# EAGLE design ESP07_CarSentry (EAGLE 8.4.1)
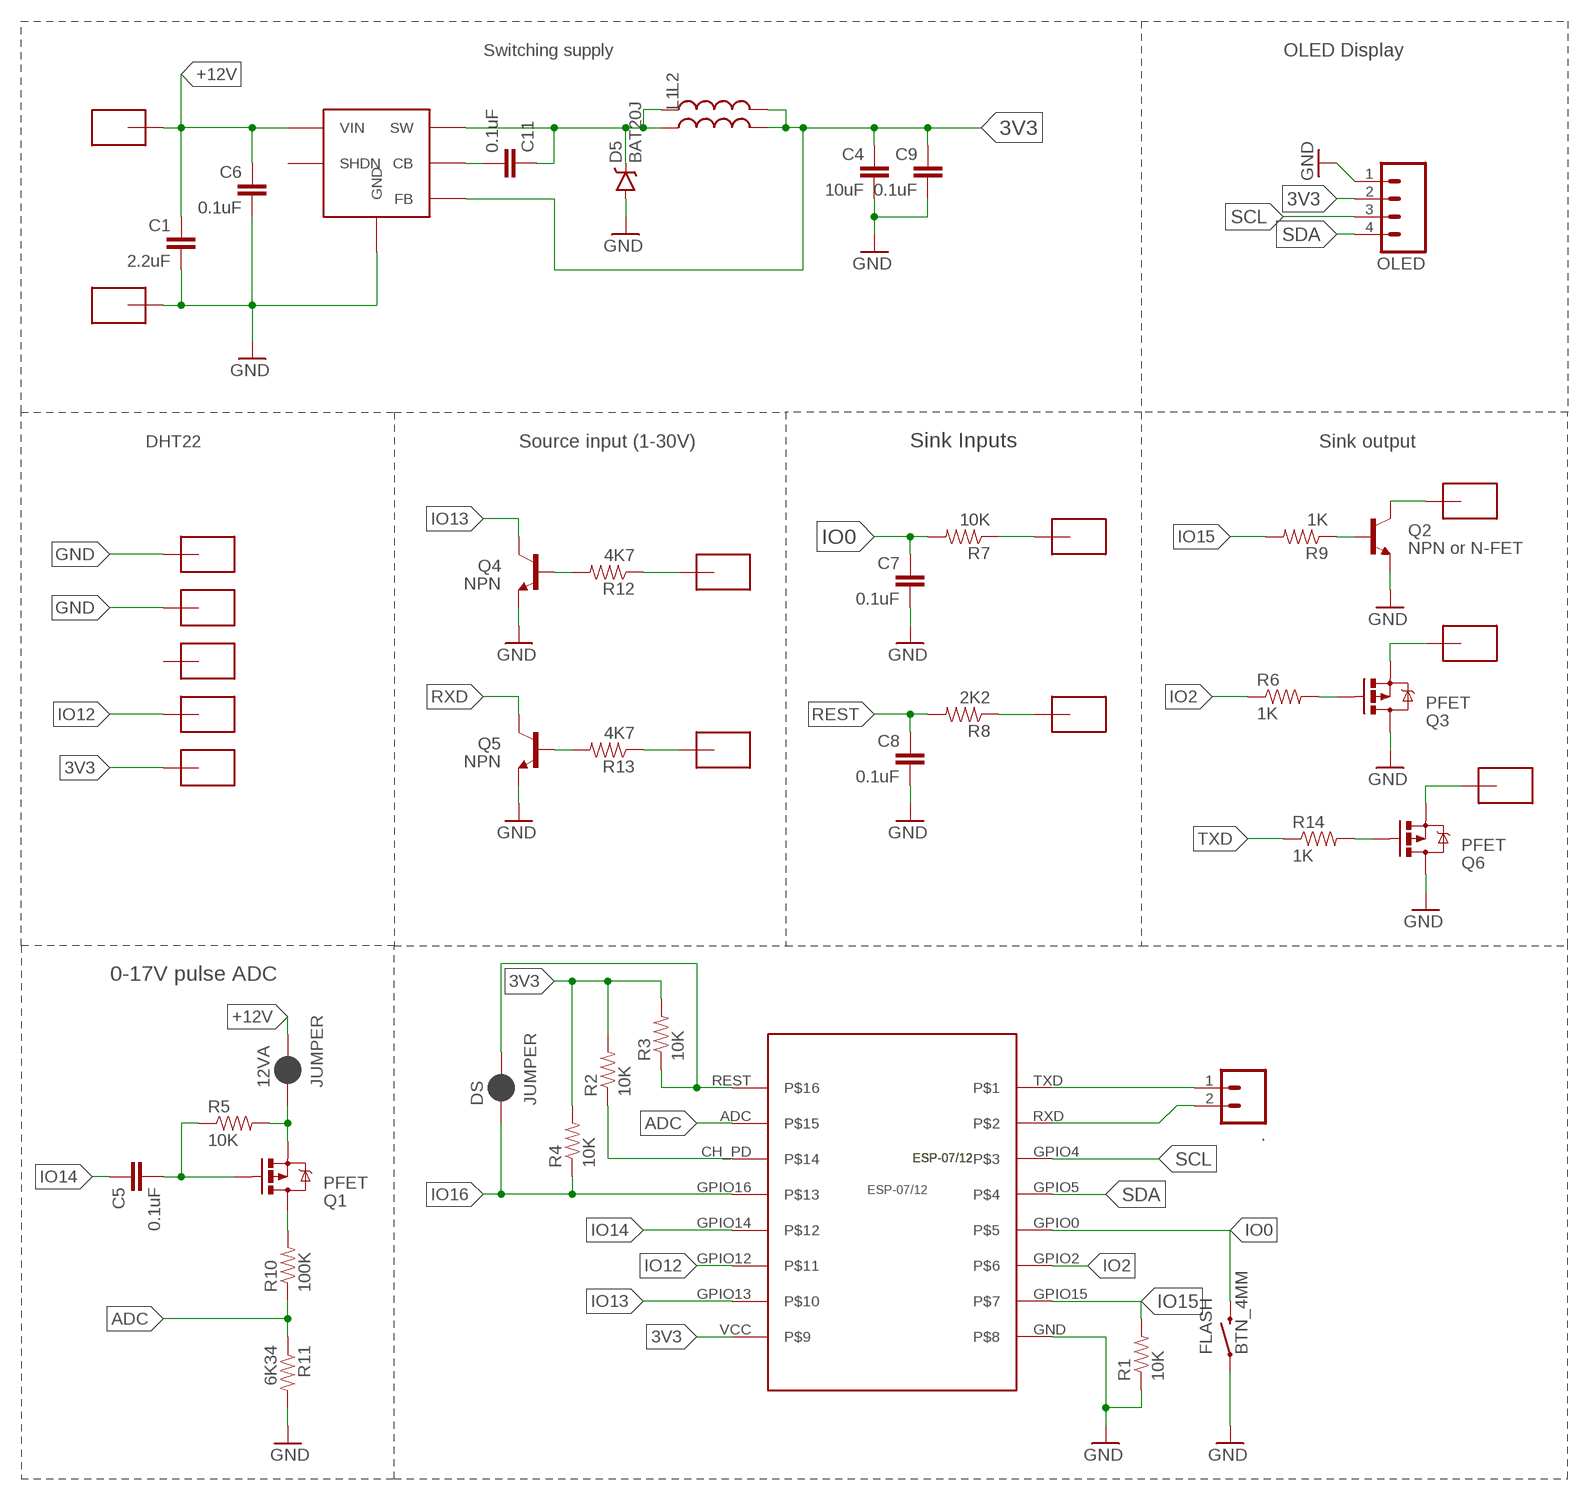
[diagram p0: schematic, sheet 1]

## Parts
12VA  JUMPER  JUMPER-PAD-2-NC_BY_PASTE  [PAD-JUMPER-2-NC_BY_PASTE_YES_SILK]
.  M02PTH  [1X02]
C1  2.2uF  CAP  [0805-CAP]
C4  10uF  CAP  [0805-CAP]
C5  0.1uF  CAP  [0805-CAP]
C6  0.1uF  CAP  [0805-CAP]
C7  0.1uF  CAP  [0805-CAP]
C8  0.1uF  CAP  [0805-CAP]
C9  0.1uF  CAP  [0805-CAP]
C11  0.1uF  CAP  [0805-CAP]
D5  BAT20J  DIODE-SCHOTTKY-BAT20J  [SOD-323]
DS  JUMPER  JUMPER-PAD-2-NC_BY_PASTE  [PAD-JUMPER-2-NC_BY_PASTE_YES_SILK]
FLASH  BTN_4MM  [BTN_4MM]
L1  INDUCTOR0805  [0805]
L2  INDUCTOR0805  [0805]
OLED  M04LOCK  [1X04_LOCK]
Q1  PFET  MOSFET-PCHANNEL  [SOT23-3]
Q2  NPN or N-FET  TRANSISTOR_NPNSOT23-3  [SOT23-3]
Q3  PFET  MOSFET-PCHANNEL  [SOT23-3]
Q4  NPN  TRANSISTOR_NPNSOT23-3  [SOT23-3]
Q5  NPN  TRANSISTOR_NPNSOT23-3  [SOT23-3]
Q6  PFET  MOSFET-PCHANNEL  [SOT23-3]
R1  10K  RESISTOR0805-RES  [0805]
R2  10K  RESISTOR0805-RES  [0805]
R3  10K  RESISTOR0805-RES  [0805]
R4  10K  RESISTOR0805-RES  [0805]
R5  10K  RESISTOR0805-RES  [0805]
R6  1K  RESISTOR0805-RES  [0805]
R7  10K  RESISTOR0805-RES  [0805]
R8  2K2  RESISTOR0805-RES  [0805]
R9  1K  RESISTOR0805-RES  [0805]
R10  100K  RESISTOR0805-RES  [0805]
R11  6K34  RESISTOR0805-RES  [0805]
R12  4K7  RESISTOR0805-RES  [0805]
R13  4K7  RESISTOR0805-RES  [0805]
R14  1K  RESISTOR0805-RES  [0805]
U$1  ESP-07/12  [ESP-07/12]
U$2  SMD-PAD1  [SMD-PAD1]
U$3  SMD-PAD1  [SMD-PAD1]
U$4  SMD-PAD1  [SMD-PAD1]
U$5  SMD-PAD1  [SMD-PAD1]
U$6  SMD-PAD1  [SMD-PAD1]
U$7  SMD-PAD1  [SMD-PAD1]
U$8  SMD-PAD1  [SMD-PAD1]
U$9  SMD-PAD1  [SMD-PAD1]
U$10  SMD-PAD1  [SMD-PAD1]
U$11  SMD-PAD1  [SMD-PAD1]
U$12  SMD-PAD1  [SMD-PAD1]
U$13  SMD-PAD1  [SMD-PAD1]
U$14  SMD-PAD1  [SMD-PAD1]
U$16  SMD-PAD1  [SMD-PAD1]
VREG1  LMR16006YQ3DDCRQ1  LMR16006YQ  [SOT-23-6]

## Nets
3V3: C4.1 C9.1 L1.2 L2.2 OLED.2 R2.2 R3.2 R4.2 U$1.VCC U$4.>NAME VREG1.3(FB)
+12V: 12VA.2 C1.1 C6.1 U$16.>NAME VREG1.5(VIN)
ADC: R10.1 R11.1 U$1.ADC
ADCHI: 12VA.1 Q1.2(S) R5.2
GND: C1.2 C4.2 C6.2 C7.2 C8.2 C9.2 D5.A FLASH.1 OLED.1 Q2.2(E) Q3.3(D) Q4.2(E) Q5.2(E) Q6.3(D) R1.1 R11.2 U$1.GND U$6.>NAME U$8.>NAME U$11.>NAME VREG1.2(GND)
IO0: C7.1 FLASH.2 R7.2 U$1.GPIO0
IO2: R6.1 U$1.GPIO2
IO12: U$1.GPIO12 U$5.>NAME
IO13: Q4.3(C) U$1.GPIO13
IO14: C5.1 U$1.GPIO14
IO15: R1.2 R9.2 U$1.GPIO15
IO16: DS.1 R4.1 U$1.GPIO16
N$1: Q1.3(D) R10.2
N$2: Q3.1(G) R6.2
N$3: C5.2 Q1.1(G) R5.1
N$4: Q3.2(S) U$9.>NAME
N$5: R7.1 U$14.>NAME
N$6: Q2.1(B) R9.1
N$7: Q2.3(C) U$3.>NAME
N$8: R8.1 U$12.>NAME
N$9: Q4.1(B) R12.2
N$10: R12.1 U$2.>NAME
N$11: R2.1 U$1.CH_PD
N$12: Q5.1(B) R13.2
N$13: C11.1 D5.C L1.1 L2.1 VREG1.6(SW)
N$14: C11.2 VREG1.1(CB)
N$15: R13.1 U$10.>NAME
N$16: Q6.2(S) U$13.>NAME
N$17: Q6.1(G) R14.2
REST: C8.1 DS.2 R3.1 R8.2 U$1.REST
RXD: ..2 Q5.3(C) U$1.RXD
SCL: OLED.3 U$1.GPIO4
SDA: OLED.4 U$1.GPIO5
TXD: ..1 R14.1 U$1.TXD
Unconnected: U$7.>NAME VREG1.4(SHDN)

## Notes on the sheet
- Switching supply | OLED Display
- DHT22 | Source input (1-30V) | Sink Inputs | Sink output
- 0-17V pulse ADC

## Library data of the parts
12VA DS = SparkFun-Passives:JUMPER-PAD-2-NC_BY_PASTE
. = SparkFun-Connectors:M02: Standard 2-pin 0.1" header. Use with - straight break away headers ( PRT-00116) - right angle break away headers (PRT-00553) - swiss pins (PRT-00743) - machine pins (PRT-00117) - female headers (PRT-00115) Molex polarized connector foot print use with: PRT-08233 with associated crimp pins and housings. 2.54_SCREWTERM for use with PRT-10571. 3.5mm Screw Terminal footprints for PRT-08084 5mm Screw Terminal footprints for use with PRT-08432
C1 C4-C9 C11 = SparkFun-Capacitors:CAP: Capacitor Standard 0603 ceramic capacitor, and 0.1" leaded capacitor.
D5 = SparkFun-DiscreteSemi:DIODE-SCHOTTKY: Schottky diodes in SFE's production catalog BAT20J 1A 23V 0.62Vf RB751 120mA 40V 0.37Vf PMEG4005EJ 0.5A 40V 0.42Vf MBRA140 1A 40V 0.5Vf B340A 3A 40V SMA; PROD_ID: DIO-11623
FLASH = CuriousTech:BTN_4MM
L1 L2 = SparkFun-Passives:INDUCTOR: Inductors Basic Inductor/Choke - 0603 and 1206. Footprints are not proven and vary greatly between part numbers. INDUCTOR POWER 3.3UH 4.0A SMD 0.197" L x 0.197" W x 0.177" H (5.00mm x 5.00mm x 4.50mm)
OLED = SparkFun-Connectors:M04: Header 4 Standard 4-pin 0.1" header. Use with straight break away headers (SKU : PRT-00116), right angle break away headers (PRT-00553), swiss pins (PRT-00743), machine pins (PRT-00117), and female headers (PRT-00115). Molex polarized connector foot print use with SKU : PRT-08231 with associated crimp pins and housings. 1MM SMD Version SKU: PRT-10208; PROD_ID: CONN-09696
Q1 Q3 Q6 = SparkFun-DiscreteSemi:MOSFET-PCHANNEL: Generic PMOSFET IRLML2244 - TRANS-11153 (SOT-23 -20V -4.3A) (1.Gate 2.Source 3.Drain) FQP27P06 - COM-10349 <http://www.sparkfun.com/products/10349> (TO-220 -60V -27A) (1.Gate 2.Source 3.Drain); PROD_ID: TRANS-08285
Q2 Q4 Q5 = SparkFun-DiscreteSemi:TRANSISTOR_NPN: Generic NPN BJT MMBT2222A - TRANS-08049 (SOT-23, 1A 40V) MPSA42 - TRANS-09116 (SOT-23, 500mA 300V) MMBT5088LT1G - TRANS-11160 (SOT-23, 50 mA 30V) BC547 - COM-08928 <http://www.sparkfun.com/products/8928> (TO-92 45V 100mA) (1.Collector 2.Base 3.Emitter) 2N3904 - COM-00521 <http://www.sparkfun.com/products/521> (TO-92 40V 200mA) (1.Emitter 2.Base 3.Collector) P2N2222A - COM-12852 <http://www.sparkfun.com/products/12852> (TO-92 40V 600mA) (1.Collector 2.Base 3.Emitter); PROD_ID: TRANS-08049
R1-R14 = SparkFun-Resistors:RESISTOR: Resistor Basic schematic elements and footprints for 0603, 1206, and PTH resistors.
U$1 = ESP-07_12:ESP-07/12: Version 1.0 of the library for the ESP-07/12 full GPIO dev board module byME Jon jonnyradu@gmail.com
U$2-U$14 U$16 = CuriousTech:SMD-PAD1: SMD-PAD small
VREG1 = CuriousTech:LMR16006YQ

## Board
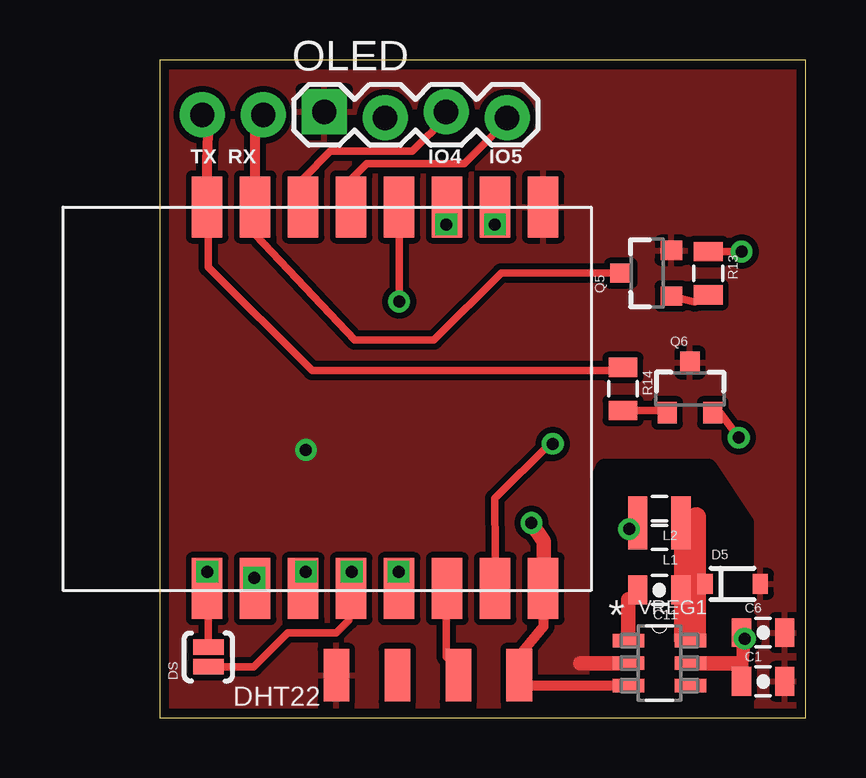
[diagram p1: board, top side]
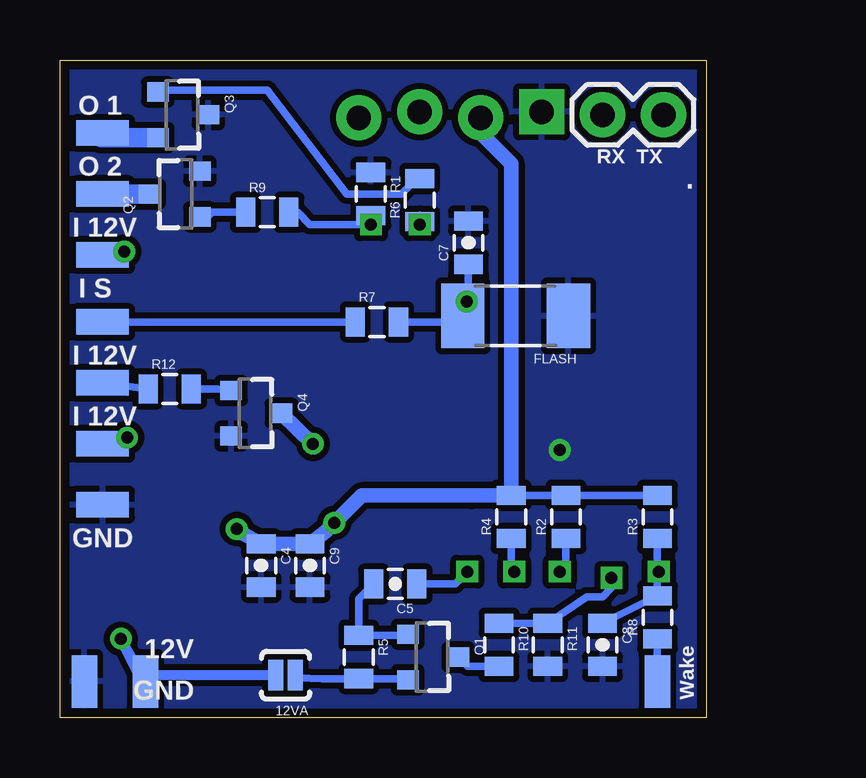
[diagram p2: board, bottom side, seen from below]

Size 26.92 x 27.43 mm. Coordinates in mm from the lower left corner, seen from the top.
Outline: 26.92,0 26.92,27.43 0,27.43 0,0 26.92,0
Copper layers (1*16): Top 0.035mm / dielectric 1.5mm / Bottom 0.035mm
Design rules "default *": minimum track width 10mil, minimum drill 24mil, track to track 8mil, track to pad 8mil, pad to pad 8mil, via to via 8mil, smd to smd 8mil, copper to edge 15mil, drill to drill 8mil, minimum pad ring 10mil, minimum via ring 8mil, stop-mask expansion 4mil, vias tented up to drill 0mil, thermal gap 10mil
tRestrict: area 18.3,0.5 to 24.4,10.4

### Footprints (pad centres in the part's own frame; a part is rotated, then mirrored left to right if it is on the bottom)
PAD-JUMPER-2-NC_BY_PASTE_YES_SILK = smd 0.635 x 1.27: 1 -0.401,0; 2 0.413,0
1X02 = drill 1.016 pad 1.88: 1 0,0; 2 2.54,0
0805-CAP = smd 0.8 x 1.2: 1 -0.9,0; 2 0.9,0
SOD-323 = smd 0.63 x 0.83: A 1.15,0; C -1.15,0
BTN_4MM = smd 1.8 x 2.7: 1 -2.2,0; 2 2.2,0
0805 = smd 0.8 x 1.2: 1 -0.9,0; 2 0.9,0
1X04_LOCK = drill 1.016 pad 1.88 square: 1 0,0.127 | drill 1.016 pad 1.88: 2 2.54,-0.127; 3 5.08,0.127; 4 7.62,-0.127
SOT23-3 = smd 0.8 x 0.9: 1 -0.95,-1; 2 0.95,-1; 3 0,1.1
ESP-07/12 = smd 2.54 x 1.27: ADC 0.1,14; CH_PD 0.1,12; GND 16,2; GPIO0 16,8; GPIO2 16,6; GPIO4 16,12; GPIO5 16,10; GPIO12 0.1,6; GPIO13 0.1,4; GPIO14 0.1,8; GPIO15 16,4; GPIO16 0.1,10; REST 0.1,16; RXD 16,14; TXD 16,16; VCC 0.1,2
SMD-PAD1 = smd 2.184 x 1.067: >NAME 0,0
SOT-23-6 = smd 1.321 x 0.559: 1 -1.295,0.94; 2 -1.295,0; 3 -1.295,-0.94; 4 1.295,-0.94; 5 1.295,0; 6 1.295,0.94

### Placement (x,y rotation side)
12VA  17.53,1.78 180 bottom
.  1.78,25.15 180 bottom
C1  25.15,1.52 0 top
C4  18.54,6.35 270 bottom
C5  12.95,5.59 180 bottom
C6  25.15,3.56 0 top
C7  9.91,19.81 90 bottom
C8  4.32,3.05 270 bottom
C9  16.51,6.35 270 bottom
C11  20.83,5.33 180 top
D5  23.88,5.59 0 top
DS  2.03,2.54 90 top
FLASH  7.94,16.76 180 bottom
L1  20.83,7.62 180 top
L2  20.83,8.64 180 top
OLED  6.86,25.15 0 top
Q1  11.43,2.54 270 bottom
Q2  22.1,21.84 90 bottom
Q3  21.84,25.15 270 bottom
Q4  18.8,12.7 270 bottom
Q5  20.32,18.54 90 top
Q6  22.1,13.72 0 top
R1  13.97,21.84 270 bottom
R2  5.84,8.38 90 bottom
R3  2.03,8.38 90 bottom
R4  8.13,8.38 90 bottom
R5  14.48,2.54 270 bottom
R6  11.94,21.59 90 bottom
R7  13.72,16.51 0 bottom
R8  2.03,4.19 90 bottom
R9  18.29,21.08 0 bottom
R10  8.64,3.05 270 bottom
R11  6.6,3.05 270 bottom
R12  22.35,13.72 0 bottom
R13  22.86,18.54 270 top
R14  19.3,13.72 270 top
U$1  17.98,5.3 90 top
U$2  25.15,13.97 0 bottom
U$3  25.15,21.84 0 bottom
U$4  14.99,1.78 90 top
U$5  12.45,1.78 90 top
U$6  25.91,1.52 270 bottom
U$7  9.91,1.78 90 top
U$8  7.37,1.78 90 top
U$9  25.15,24.38 0 bottom
U$10  25.15,19.3 0 bottom
U$11  25.15,8.89 0 bottom
U$12  2.03,1.52 270 bottom
U$13  25.15,11.43 0 bottom
U$14  25.15,16.51 0 bottom
U$16  23.37,1.52 270 bottom
VREG1  20.83,2.29 0 top

### Tracks (layer width: path | path; a pad name or v marks a point on that pad's centre or on a via)
3V3  (via drill 0.5)
  Top 0.305: 15.42,1.35 U$4.>NAME
  Top 0.406: U$4.>NAME 14.73,2.29 16,3.81 16,5.37 U$1.VCC | VREG1.3 15.42,1.35
  Top 0.61: 16,5.08 16,5.42 | 16,5.42 U$1.VCC | v15.49,8.13 16,7.37 16,5.42 | L2.2 L1.2 19.67,7.87 v19.56,7.87
  Bottom 0.305: R3.2 R2.2 R4.2
  Bottom 0.61: OLED.2 9.4,24.38 8.13,23.11 R4.2 9.26,9.28 9.78,9.27 14.35,9.27 v15.49,8.13 15.86,7.76 C9.1 C4.1 19.44,7.76 v19.56,7.87
+12V  (via drill 0.5)
  Top 0.406: v24.38,3.3 24.38,2.93 C1.1 | C1.1 C6.1 | 23.99,2.29 C1.1
  Top 0.61: VREG1.5 23.99,2.29
  Bottom 0.406: 12VA.2 23.62,1.78 v24.38,3.3 24.25,3.16 24.25,3.05 U$16.>NAME
ADC  (via drill 0.5)
  Top 0.305: v3.95,5.84 3.81,5.33 3.91,5.33 U$1.ADC
  Bottom 0.305: v3.95,5.84 3.98,5.81 U$1.ADC 4.32,5.05 4.97,5.05 R11.1 R10.1
ADCHI
  Bottom 0.305: Q1.2 12.48,1.64 R5.2 16,1.64 17.02,1.67 12VA.1
GND  (via drill 0.5)
  Top 0.61: VREG1.2 17.53,2.29
  other vias: 6.1,11.18
  pour Top (isolate 0.254): 0,0 0,27.69 26.92,27.69 26.92,0
  pour Bottom (isolate 0.254): 26.92,0 0,0 0,27.69 26.92,27.69
IO0  (via drill 0.5)
  Top 0.305: v9.98,17.36 U$1.GPIO0
  Bottom 0.305: FLASH.2 9.88,17.52 v9.98,17.36 | v9.98,17.36 9.98,17.79 11.01,16.51 R7.2 | C7.1 9.91,17.43 v9.98,17.36
IO2  (via drill 0.5)
  Top 0.305: v11.94,20.57 11.94,21.26 U$1.GPIO2
  Bottom 0.305: 11.94,20.95 R6.1 v11.94,20.57
IO12
  Top 0.305: 11.94,5.84 12.08,5.69 12.17,5.59 | 11.94,5.36 11.94,2.54 12.19,2.29 U$5.>NAME
  Top 0.406: 11.94,5.36 U$1.GPIO12 11.98,5.59 12.08,5.69
  Top 0.61: 11.94,5.44 U$1.GPIO12
IO13  (via drill 0.5)
  Top 0.305: U$1.GPIO13 13.98,6.85 13.97,9.14 16.26,11.43 v16.38,11.43
  Bottom 0.61: Q4.3 v16.38,11.43
IO14  (via drill 0.5)
  Top 0.305: v9.96,6.1 9.91,6.09 U$1.GPIO14
  Bottom 0.305: C5.1 10.46,5.59 v9.96,6.1
IO15  (via drill 0.5)
  Top 0.305: U$1.GPIO15 | U$1.GPIO15 v13.98,20.57 v13.97,20.57 U$1.GPIO15
  Bottom 0.305: R1.2 v13.97,20.57 16.51,20.57 17.02,21.08 R9.2
IO16  (via drill 0.5)
  Top 0.305: DS.1 3.92,2.14 5.33,3.56 7.37,3.56 7.87,4.06 7.87,5.3 U$1.GPIO16 7.98,6.45 v8,6.1
  Bottom 0.305: R4.1 8.13,6.22 v8,6.1
N$1
  Bottom 0.305: 8.6,2.2 R10.2 9.94,2.15 Q1.3
N$2
  Bottom 0.305: R6.2 12.05,22.49 12.7,21.84 14.99,21.84 18.29,26.16 23.03,26.16 Q3.1
N$3
  Bottom 0.305: C5.2 14.48,4.96 R5.1 12.48,3.44 Q1.1
  Bottom 0.406: 14.34,3.3 R5.1
N$4
  Bottom 0.813: Q3.2 25.21,24.2 U$9.>NAME
N$5
  Bottom 0.305: R7.1 U$14.>NAME
N$6
  Bottom 0.305: R9.1 20.57,21.08 20.83,20.83 21.03,20.83 Q2.1
N$7
  Bottom 0.813: Q2.3 U$3.>NAME
N$8
  Bottom 0.305: R8.1 U$12.>NAME
N$9
  Bottom 0.305: R12.2 20.37,13.72 Q4.1
N$10
  Bottom 0.305: R12.1 U$2.>NAME
N$11  (via drill 0.5)
  Top 0.305: v6.1,6.1 5.98,6.1 U$1.CH_PD
  Top 0.406: 6.03,5.4 U$1.CH_PD
  Bottom 0.305: R2.1 5.84,6.35 v6.1,6.1
N$12
  Top 0.305: Q5.1 22.3,17.34 R13.2
N$13
  Top 0.406: 22.35,3.56 22.35,3.45 VREG1.6
  Top 0.61: VREG1.6 21.73,3.23 21.73,5.08 | 21.73,5.08 C11.1 L1.1 L2.1 | D5.C 21.73,5.08
  Top 0.813: 22.35,8.38 22.35,3.56
N$14
  Top 0.406: 19.53,4.94 C11.2
  Top 0.61: VREG1.1 19.53,4.94
N$15  (via drill 0.5)
  Top 0.305: R13.1 v24.25,19.44
  Bottom 0.305: v24.25,19.44 U$10.>NAME
N$16  (via drill 0.5)
  Top 0.305: Q6.2 23.35,12.72 v24.13,11.68
  Bottom 0.305: v24.13,11.68 24.89,11.68 U$13.>NAME
N$17
  Top 0.305: R14.2 21.05,12.82 Q6.1
REST  (via drill 0.5)
  Top 0.305: U$1.REST 1.98,5.27 2.03,5.22 | 2.03,5.45 v1.98,6.1 2.03,5.22 | DS.2 2.03,5.22
  Bottom 0.305: 1.98,7.48 R3.1 2.03,6.15 v1.98,6.1 2.03,6.04 R8.2 4.08,4.06 C8.1
RXD
  Top 0.305: U$1.RXD 3.98,20.15 8.13,15.75 11.43,15.75 14.22,18.54 Q5.3
  Top 0.406: U$1.RXD 3.98,24.47 ..2
SCL
  Top 0.305: U$1.GPIO4 5.98,22.49 7.11,23.62 10.53,23.62 11.94,25.03 OLED.3
SDA
  Top 0.305: U$1.GPIO5 7.98,22.45 8.64,23.11 12.7,23.11 14.36,24.78 14.56,24.91 | OLED.4 14.56,24.91 | OLED.4 14.41,25.02 14.56,24.91
TXD
  Top 0.305: U$1.TXD 2.03,21.24 2.03,18.8 6.35,14.48 19.17,14.48 R14.1
  Top 0.406: U$1.TXD 1.98,23.17 2.03,24.38 ..1

### Text on the board
tPlace: TX RX | IO4 | IO5 | DHT22
bPlace: O 1 | RX TX | O 2 | I 12V | I S | I 12V | I 12V | GND | 12V | Wake | GND
tStop: ESP-07
bStop: Car Sentry | CuriousTech.net